# Altium schematic sheet hall_strip.SchDoc
size A4
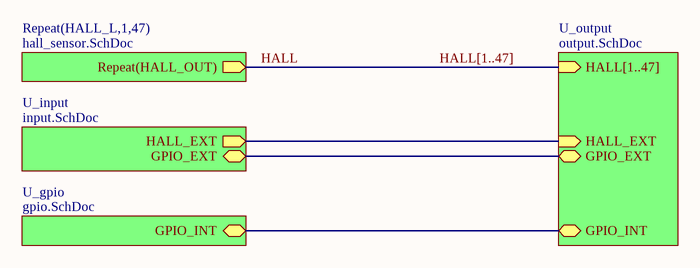
[diagram p0: hall_strip.SchDoc]

## Sub-sheets
Repeat(HALL_L,1,47) = hall_sensor.SchDoc: Repeat(HALL_OUT) (out)
U_gpio = gpio.SchDoc: GPIO_INT (bidir)
U_input = input.SchDoc: HALL_EXT (out), GPIO_EXT (bidir)
U_output = output.SchDoc: HALL[1..47] (in), GPIO_EXT (bidir), GPIO_INT (bidir), HALL_EXT (in)

## Nets
HALL: sheet Repeat(HALL_L,1,47)/Repeat(HALL_OUT)
(unnamed): sheet U_output/GPIO_EXT, sheet U_input/GPIO_EXT
(unnamed): sheet U_output/GPIO_INT, sheet U_gpio/GPIO_INT
(unnamed): sheet U_output/HALL_EXT, sheet U_input/HALL_EXT

## Buses and harness runs
bus HALL[1..47] = sheet U_output/HALL[1..47]